# EAGLE schematic gustav2.0 (EAGLE 7.3.0)
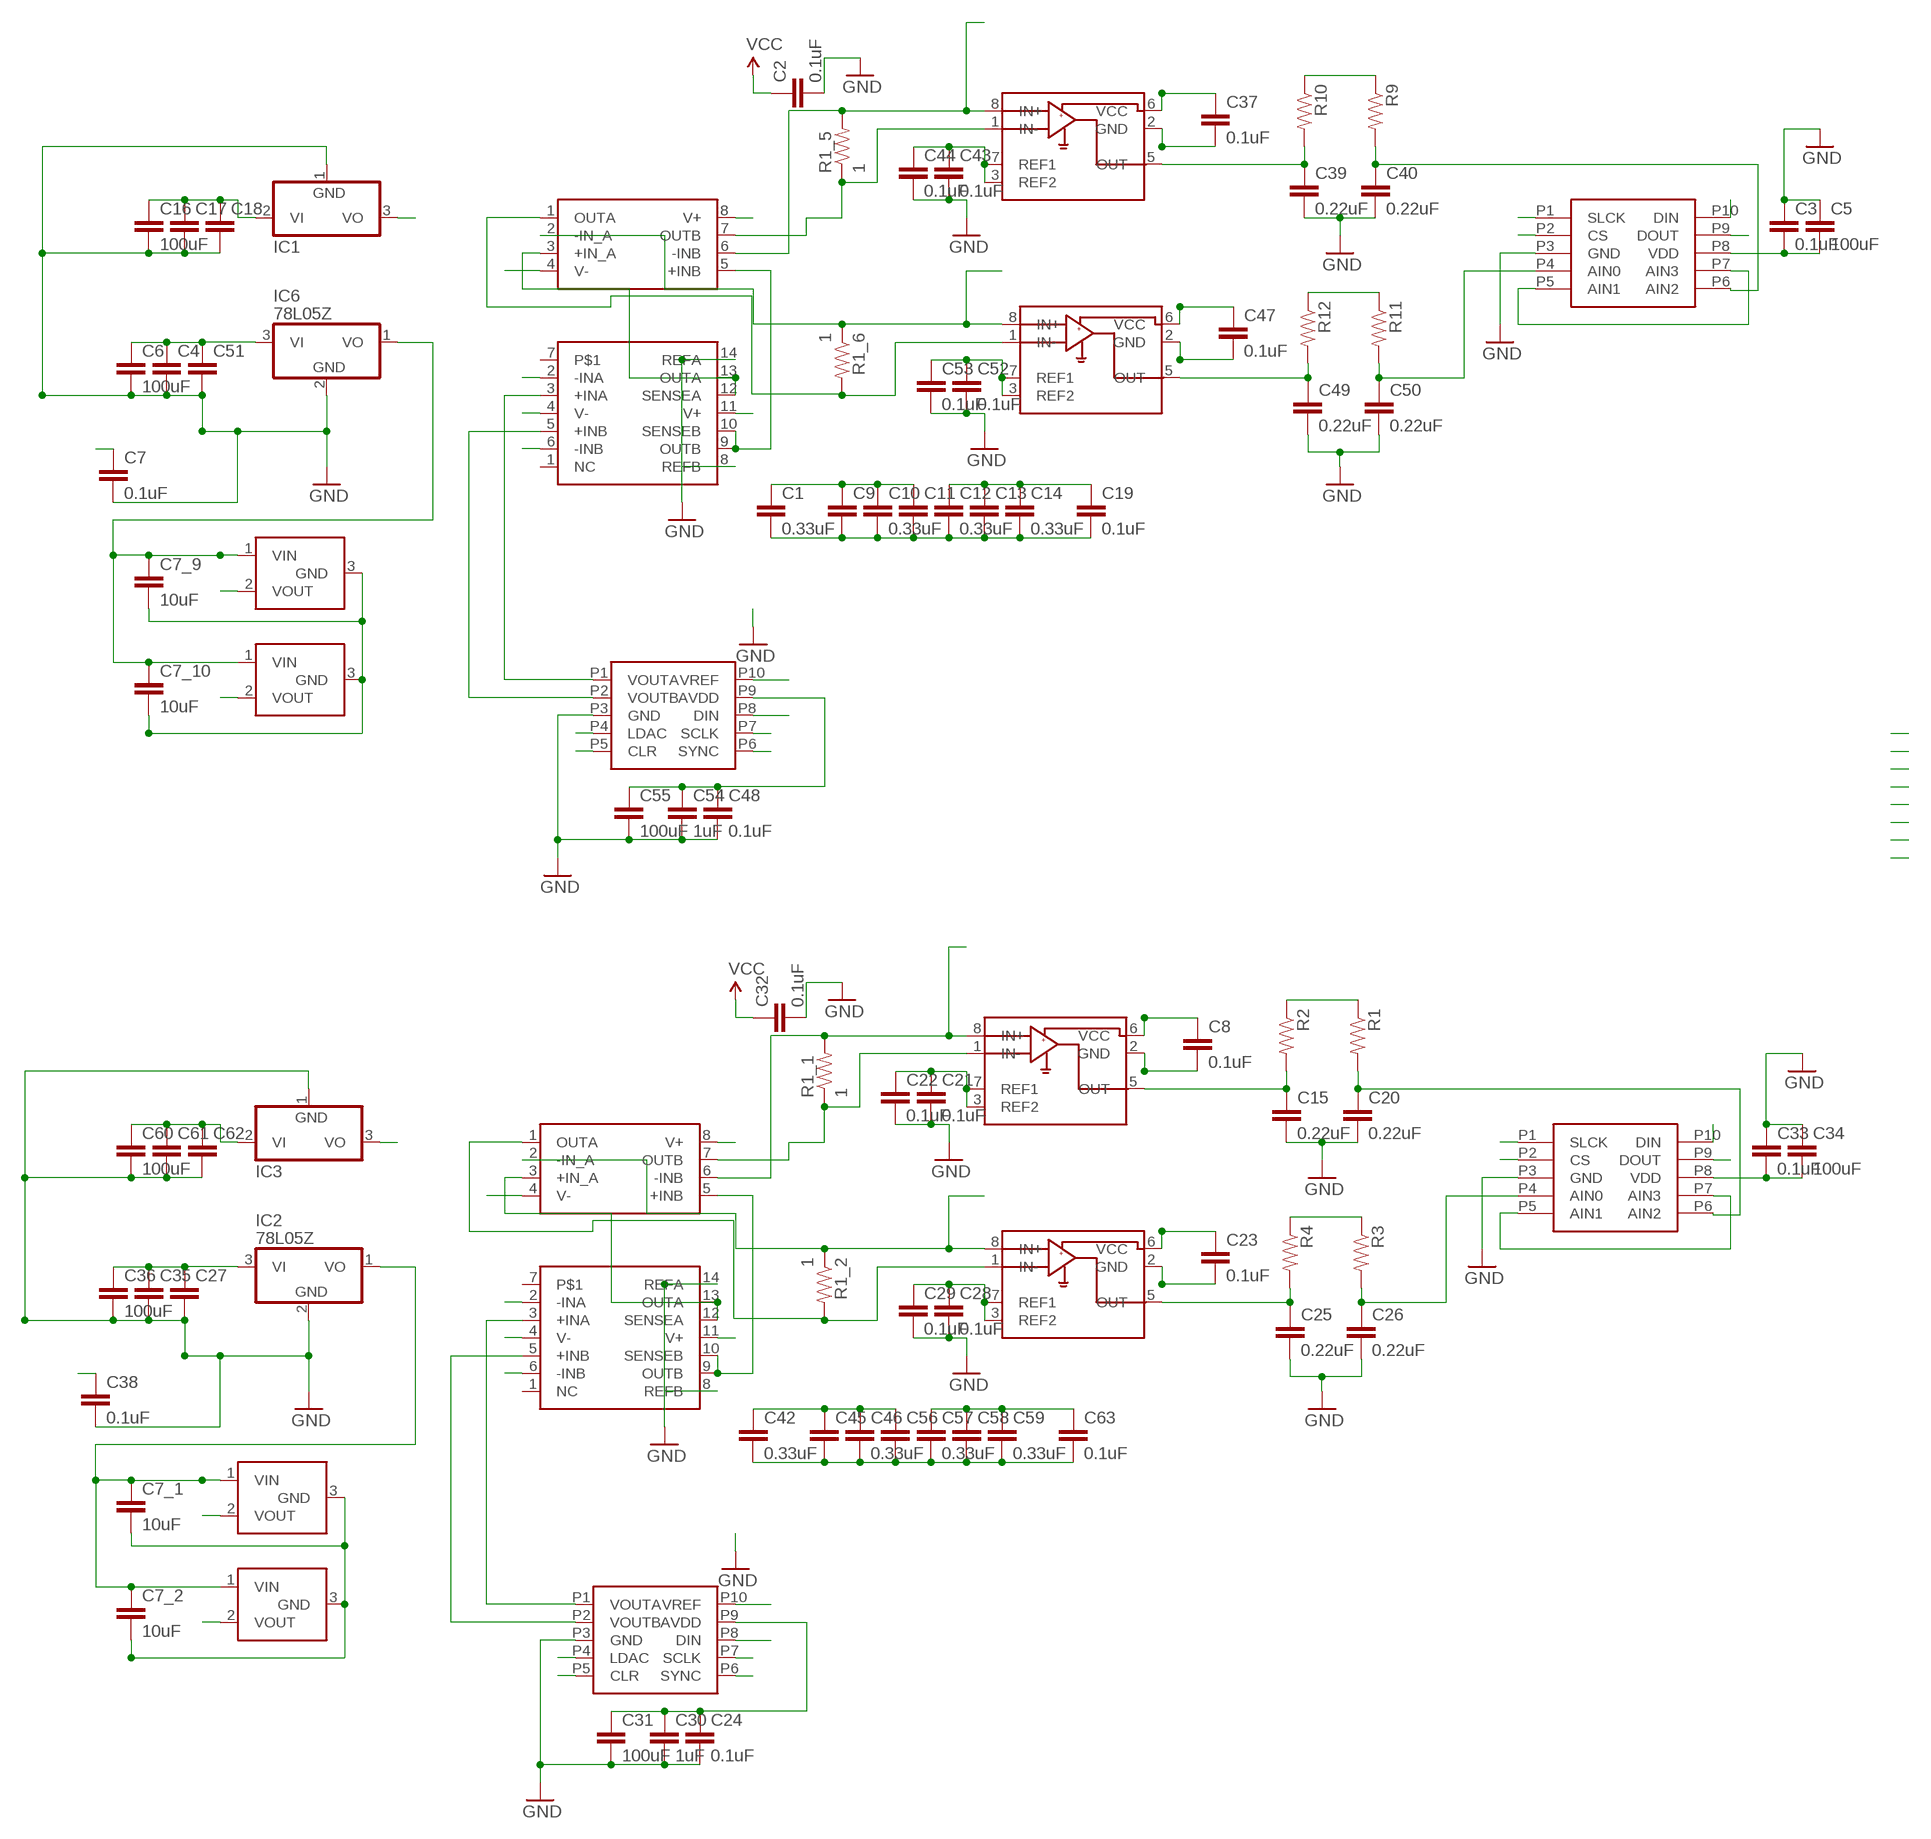
[diagram p0: schematic, sheet 1, part 1 of 3]
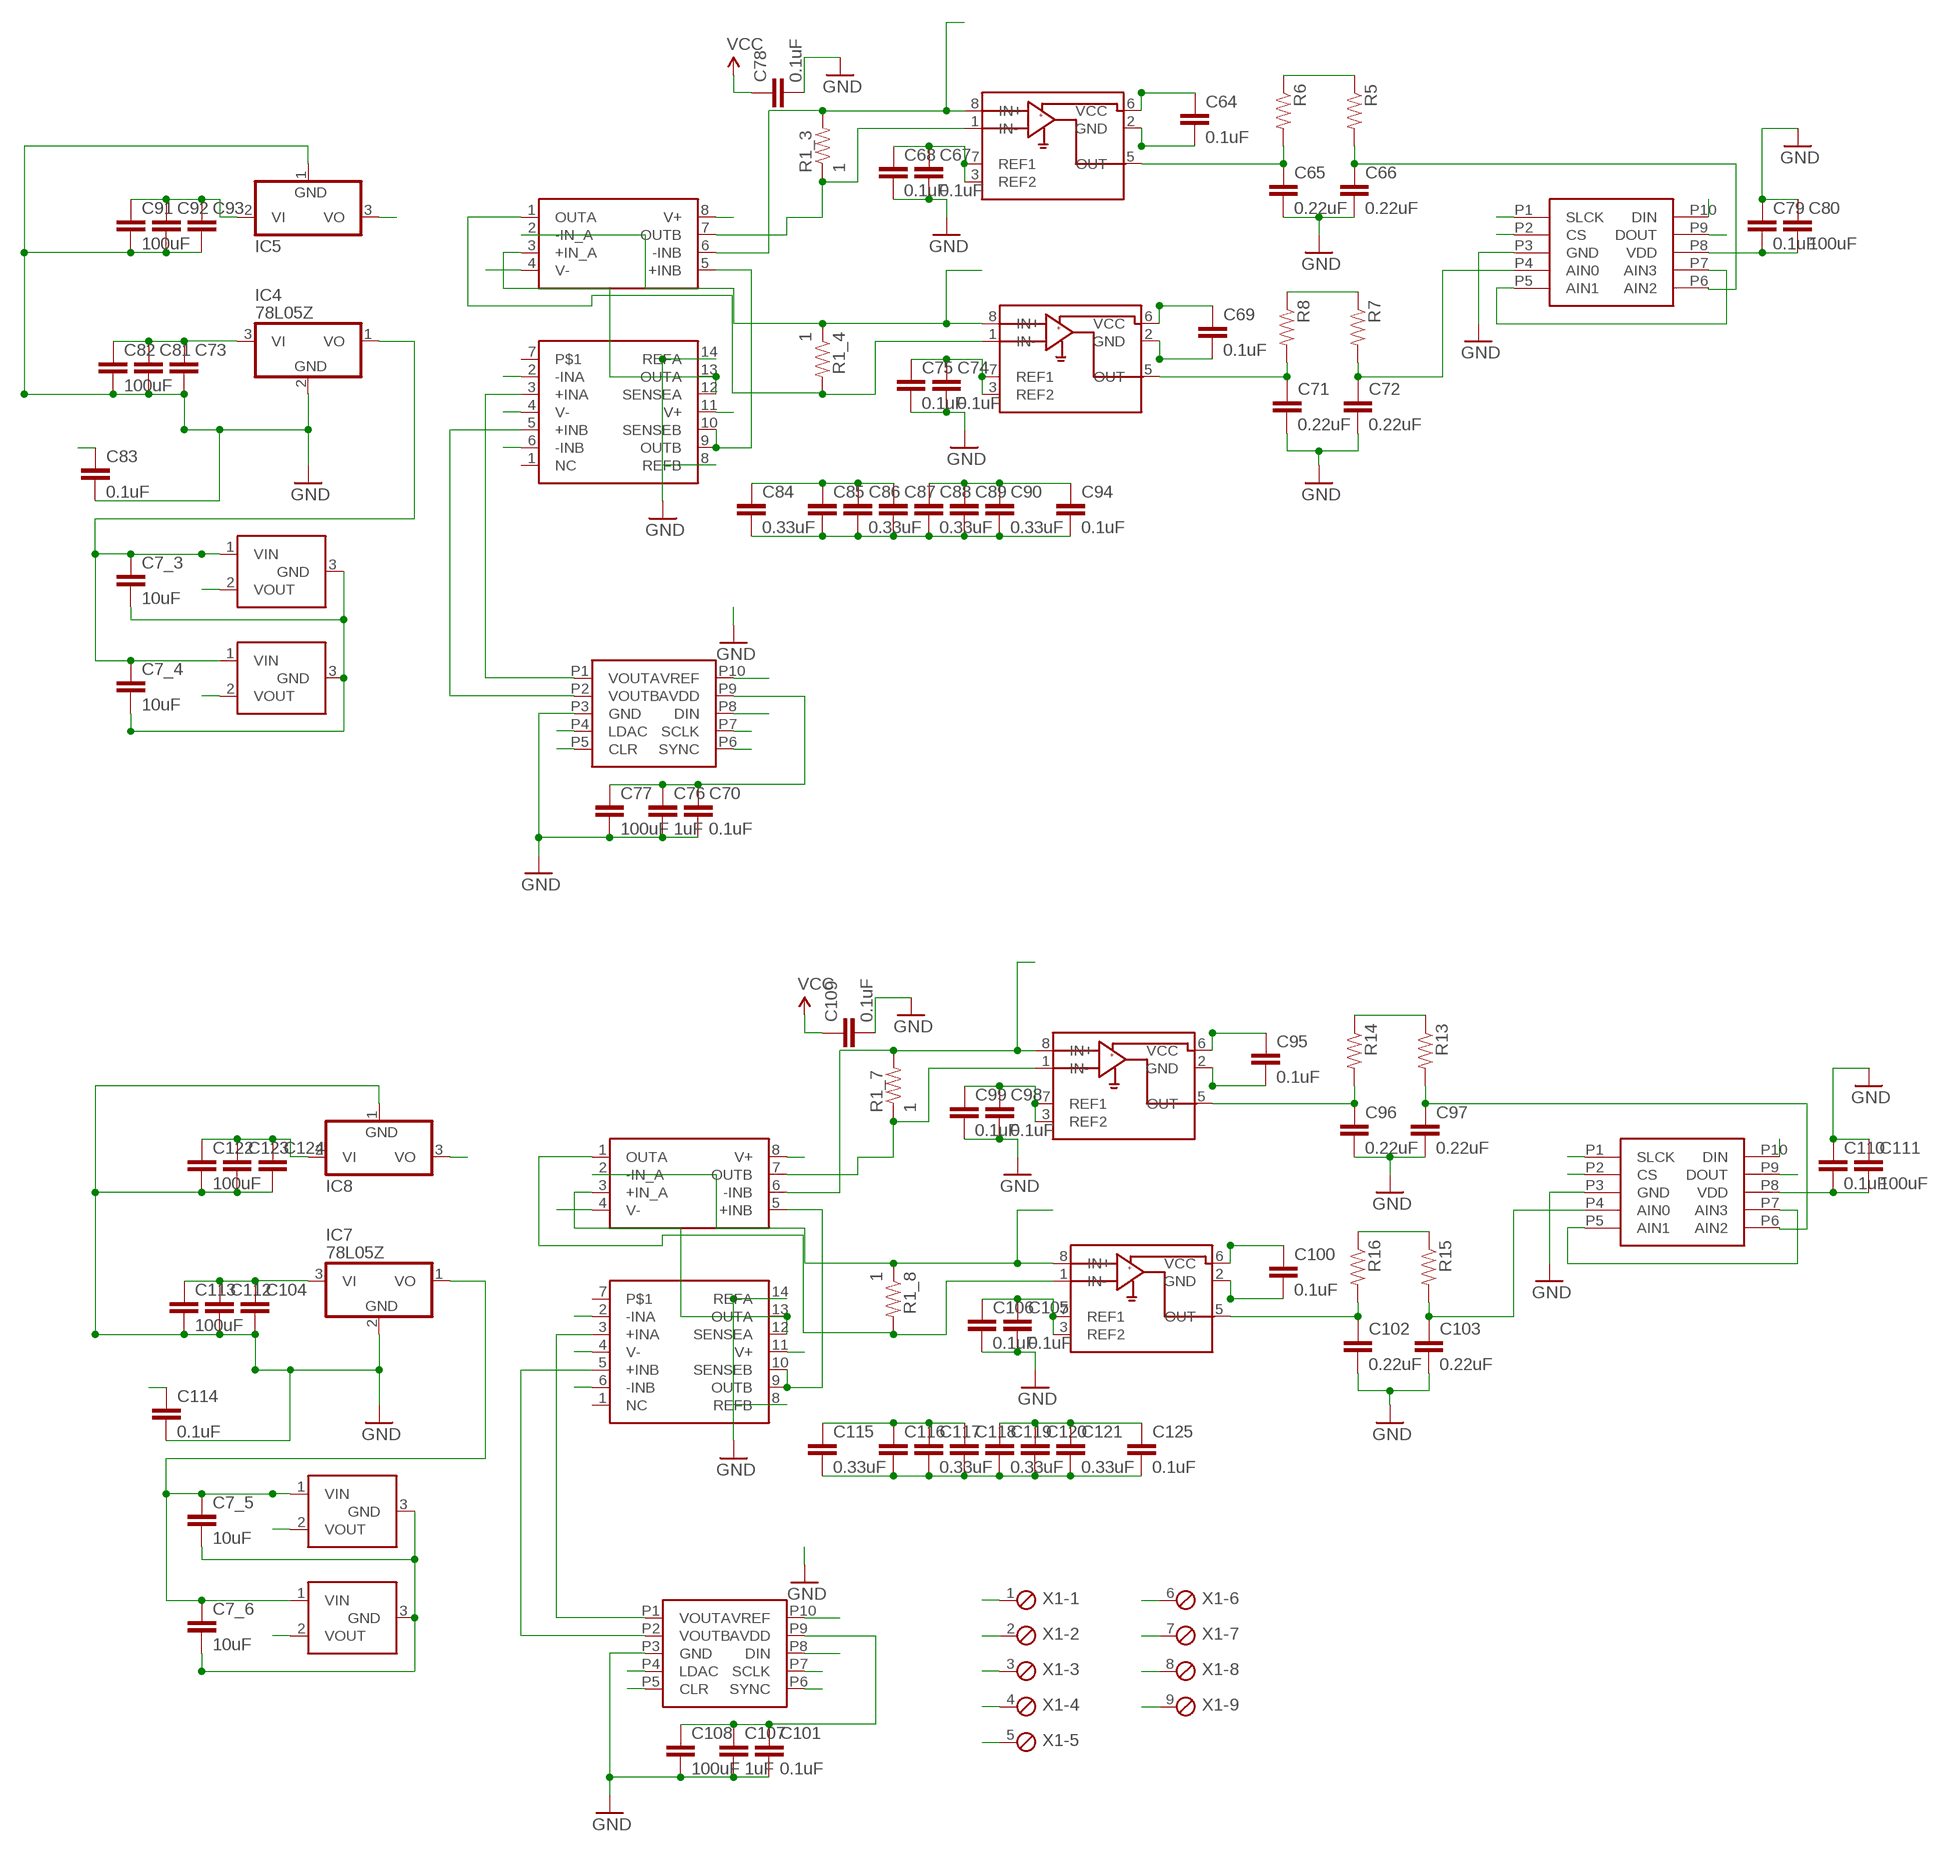
[diagram p1: schematic, sheet 1, part 2 of 3]
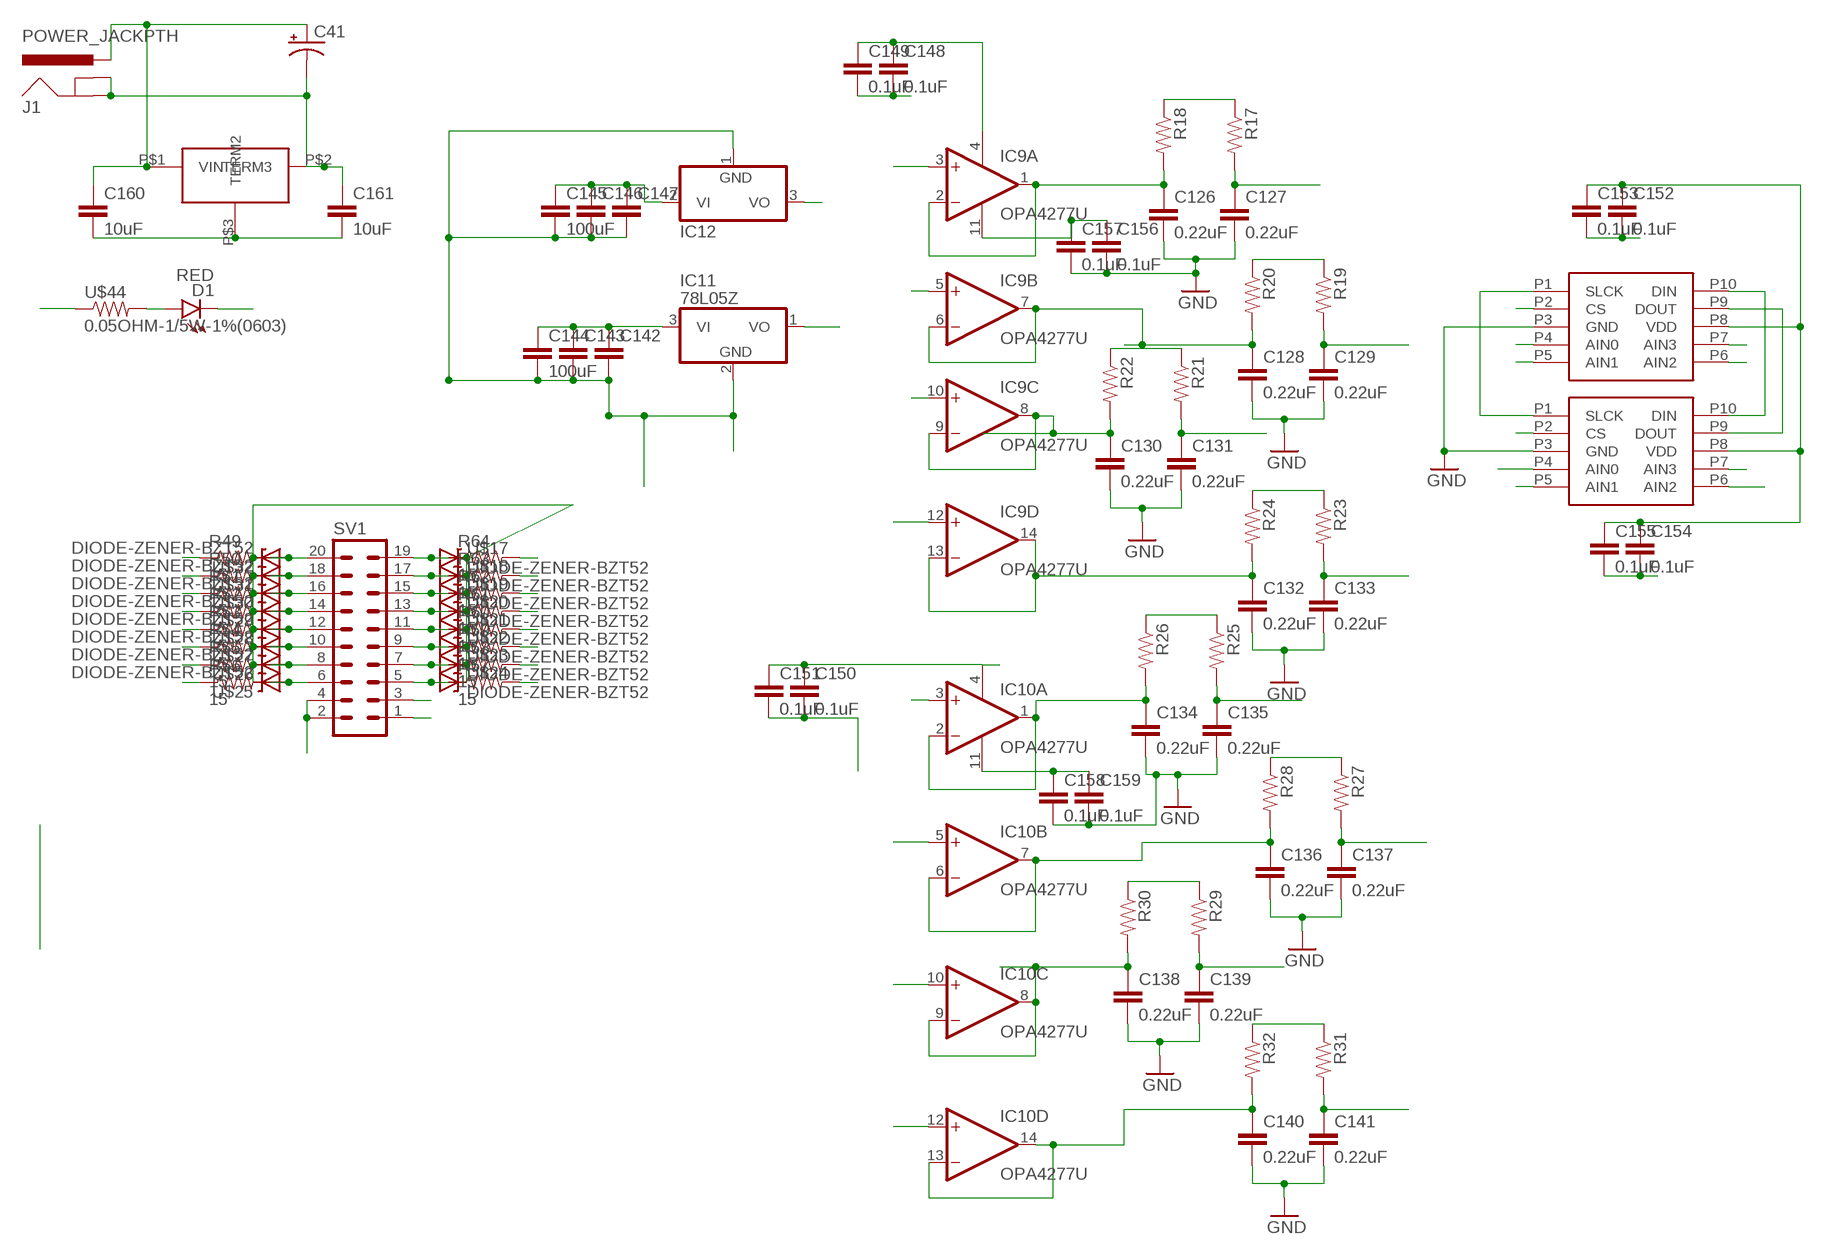
[diagram p2: schematic, sheet 1, part 3 of 3]

## Parts
C1  0.33uF  0.33UF-50V-10%(0805)  [0805-CAP]
C2  0.1uF  CAP0603-CAP  [0603-CAP]
C3  0.1uF  CAP0603-CAP  [0603-CAP]
C4  CAP0603-CAP  [0603-CAP]
C5  100uF  1.0UF50V10%(1206)  [1206-CAP]
C6  100uF  1.0UF50V10%(1206)  [1206-CAP]
C7  0.1uF  0.1UF-25V-5%(0603)  [0603-CAP]
C7_1  10uF  CAP0603-CAP  [0603-CAP]
C7_2  10uF  CAP0603-CAP  [0603-CAP]
C7_3  10uF  CAP0603-CAP  [0603-CAP]
C7_4  10uF  CAP0603-CAP  [0603-CAP]
C7_5  10uF  CAP0603-CAP  [0603-CAP]
C7_6  10uF  CAP0603-CAP  [0603-CAP]
C7_9  10uF  CAP0603-CAP  [0603-CAP]
C7_10  10uF  CAP0603-CAP  [0603-CAP]
C8  0.1uF  CAP0603-CAP  [0603-CAP]
C9  CAP0603-CAP  [0603-CAP]
C10  0.33uF  0.33UF-50V-10%(0805)  [0805-CAP]
C11  CAP0603-CAP  [0603-CAP]
C12  0.33uF  0.33UF-50V-10%(0805)  [0805-CAP]
C13  CAP0603-CAP  [0603-CAP]
C14  0.33uF  0.33UF-50V-10%(0805)  [0805-CAP]
C15  0.22uF  0.22UF50V-20%,+80%(0603)  [0603-CAP]
C16  100uF  1.0UF50V10%(1206)  [1206-CAP]
C17  CAP0603-CAP  [0603-CAP]
C18  CAP0603-CAP  [0603-CAP]
C19  0.1uF  0.1UF-25V-5%(0603)  [0603-CAP]
C20  0.22uF  0.22UF50V-20%,+80%(0603)  [0603-CAP]
C21  0.1uF  CAP0603-CAP  [0603-CAP]
C22  0.1uF  CAP0603-CAP  [0603-CAP]
C23  0.1uF  CAP0603-CAP  [0603-CAP]
C24  0.1uF  CAP0603-CAP  [0603-CAP]
C25  0.22uF  0.22UF50V-20%,+80%(0603)  [0603-CAP]
C26  0.22uF  0.22UF50V-20%,+80%(0603)  [0603-CAP]
C27  CAP0603-CAP  [0603-CAP]
C28  0.1uF  CAP0603-CAP  [0603-CAP]
C29  0.1uF  CAP0603-CAP  [0603-CAP]
C30  1uF  CAP0603-CAP  [0603-CAP]
C31  100uF  1.0UF50V10%(1206)  [1206-CAP]
C32  0.1uF  CAP0603-CAP  [0603-CAP]
C33  0.1uF  CAP0603-CAP  [0603-CAP]
C34  100uF  1.0UF50V10%(1206)  [1206-CAP]
C35  CAP0603-CAP  [0603-CAP]
C36  100uF  1.0UF50V10%(1206)  [1206-CAP]
C37  0.1uF  CAP0603-CAP  [0603-CAP]
C38  0.1uF  0.1UF-25V-5%(0603)  [0603-CAP]
C39  0.22uF  0.22UF50V-20%,+80%(0603)  [0603-CAP]
C40  0.22uF  0.22UF50V-20%,+80%(0603)  [0603-CAP]
C41  CAP_POLPTH1  [CPOL-RADIAL-100UF-25V]
C42  0.33uF  0.33UF-50V-10%(0805)  [0805-CAP]
C43  0.1uF  CAP0603-CAP  [0603-CAP]
C44  0.1uF  CAP0603-CAP  [0603-CAP]
C45  CAP0603-CAP  [0603-CAP]
C46  0.33uF  0.33UF-50V-10%(0805)  [0805-CAP]
C47  0.1uF  CAP0603-CAP  [0603-CAP]
C48  0.1uF  CAP0603-CAP  [0603-CAP]
C49  0.22uF  0.22UF50V-20%,+80%(0603)  [0603-CAP]
C50  0.22uF  0.22UF50V-20%,+80%(0603)  [0603-CAP]
C51  CAP0603-CAP  [0603-CAP]
C52  0.1uF  CAP0603-CAP  [0603-CAP]
C53  0.1uF  CAP0603-CAP  [0603-CAP]
C54  1uF  CAP0603-CAP  [0603-CAP]
C55  100uF  1.0UF50V10%(1206)  [1206-CAP]
C56  CAP0603-CAP  [0603-CAP]
C57  0.33uF  0.33UF-50V-10%(0805)  [0805-CAP]
C58  CAP0603-CAP  [0603-CAP]
C59  0.33uF  0.33UF-50V-10%(0805)  [0805-CAP]
C60  100uF  1.0UF50V10%(1206)  [1206-CAP]
C61  CAP0603-CAP  [0603-CAP]
C62  CAP0603-CAP  [0603-CAP]
C63  0.1uF  0.1UF-25V-5%(0603)  [0603-CAP]
C64  0.1uF  CAP0603-CAP  [0603-CAP]
C65  0.22uF  0.22UF50V-20%,+80%(0603)  [0603-CAP]
C66  0.22uF  0.22UF50V-20%,+80%(0603)  [0603-CAP]
C67  0.1uF  CAP0603-CAP  [0603-CAP]
C68  0.1uF  CAP0603-CAP  [0603-CAP]
C69  0.1uF  CAP0603-CAP  [0603-CAP]
C70  0.1uF  CAP0603-CAP  [0603-CAP]
C71  0.22uF  0.22UF50V-20%,+80%(0603)  [0603-CAP]
C72  0.22uF  0.22UF50V-20%,+80%(0603)  [0603-CAP]
C73  CAP0603-CAP  [0603-CAP]
C74  0.1uF  CAP0603-CAP  [0603-CAP]
C75  0.1uF  CAP0603-CAP  [0603-CAP]
C76  1uF  CAP0603-CAP  [0603-CAP]
C77  100uF  1.0UF50V10%(1206)  [1206-CAP]
C78  0.1uF  CAP0603-CAP  [0603-CAP]
C79  0.1uF  CAP0603-CAP  [0603-CAP]
C80  100uF  1.0UF50V10%(1206)  [1206-CAP]
C81  CAP0603-CAP  [0603-CAP]
C82  100uF  1.0UF50V10%(1206)  [1206-CAP]
C83  0.1uF  0.1UF-25V-5%(0603)  [0603-CAP]
C84  0.33uF  0.33UF-50V-10%(0805)  [0805-CAP]
C85  CAP0603-CAP  [0603-CAP]
C86  0.33uF  0.33UF-50V-10%(0805)  [0805-CAP]
C87  CAP0603-CAP  [0603-CAP]
C88  0.33uF  0.33UF-50V-10%(0805)  [0805-CAP]
C89  CAP0603-CAP  [0603-CAP]
C90  0.33uF  0.33UF-50V-10%(0805)  [0805-CAP]
C91  100uF  1.0UF50V10%(1206)  [1206-CAP]
C92  CAP0603-CAP  [0603-CAP]
C93  CAP0603-CAP  [0603-CAP]
C94  0.1uF  0.1UF-25V-5%(0603)  [0603-CAP]
C95  0.1uF  CAP0603-CAP  [0603-CAP]
C96  0.22uF  0.22UF50V-20%,+80%(0603)  [0603-CAP]
C97  0.22uF  0.22UF50V-20%,+80%(0603)  [0603-CAP]
C98  0.1uF  CAP0603-CAP  [0603-CAP]
C99  0.1uF  CAP0603-CAP  [0603-CAP]
C100  0.1uF  CAP0603-CAP  [0603-CAP]
C101  0.1uF  CAP0603-CAP  [0603-CAP]
C102  0.22uF  0.22UF50V-20%,+80%(0603)  [0603-CAP]
C103  0.22uF  0.22UF50V-20%,+80%(0603)  [0603-CAP]
C104  CAP0603-CAP  [0603-CAP]
C105  0.1uF  CAP0603-CAP  [0603-CAP]
C106  0.1uF  CAP0603-CAP  [0603-CAP]
C107  1uF  CAP0603-CAP  [0603-CAP]
C108  100uF  1.0UF50V10%(1206)  [1206-CAP]
C109  0.1uF  CAP0603-CAP  [0603-CAP]
C110  0.1uF  CAP0603-CAP  [0603-CAP]
C111  100uF  1.0UF50V10%(1206)  [1206-CAP]
C112  CAP0603-CAP  [0603-CAP]
C113  100uF  1.0UF50V10%(1206)  [1206-CAP]
C114  0.1uF  0.1UF-25V-5%(0603)  [0603-CAP]
C115  0.33uF  0.33UF-50V-10%(0805)  [0805-CAP]
C116  CAP0603-CAP  [0603-CAP]
C117  0.33uF  0.33UF-50V-10%(0805)  [0805-CAP]
C118  CAP0603-CAP  [0603-CAP]
C119  0.33uF  0.33UF-50V-10%(0805)  [0805-CAP]
C120  CAP0603-CAP  [0603-CAP]
C121  0.33uF  0.33UF-50V-10%(0805)  [0805-CAP]
C122  100uF  1.0UF50V10%(1206)  [1206-CAP]
C123  CAP0603-CAP  [0603-CAP]
C124  CAP0603-CAP  [0603-CAP]
C125  0.1uF  0.1UF-25V-5%(0603)  [0603-CAP]
C126  0.22uF  0.22UF50V-20%,+80%(0603)  [0603-CAP]
C127  0.22uF  0.22UF50V-20%,+80%(0603)  [0603-CAP]
C128  0.22uF  0.22UF50V-20%,+80%(0603)  [0603-CAP]
C129  0.22uF  0.22UF50V-20%,+80%(0603)  [0603-CAP]
C130  0.22uF  0.22UF50V-20%,+80%(0603)  [0603-CAP]
C131  0.22uF  0.22UF50V-20%,+80%(0603)  [0603-CAP]
C132  0.22uF  0.22UF50V-20%,+80%(0603)  [0603-CAP]
C133  0.22uF  0.22UF50V-20%,+80%(0603)  [0603-CAP]
C134  0.22uF  0.22UF50V-20%,+80%(0603)  [0603-CAP]
C135  0.22uF  0.22UF50V-20%,+80%(0603)  [0603-CAP]
C136  0.22uF  0.22UF50V-20%,+80%(0603)  [0603-CAP]
C137  0.22uF  0.22UF50V-20%,+80%(0603)  [0603-CAP]
C138  0.22uF  0.22UF50V-20%,+80%(0603)  [0603-CAP]
C139  0.22uF  0.22UF50V-20%,+80%(0603)  [0603-CAP]
C140  0.22uF  0.22UF50V-20%,+80%(0603)  [0603-CAP]
C141  0.22uF  0.22UF50V-20%,+80%(0603)  [0603-CAP]
C142  CAP0603-CAP  [0603-CAP]
C143  CAP0603-CAP  [0603-CAP]
C144  100uF  1.0UF50V10%(1206)  [1206-CAP]
C145  100uF  1.0UF50V10%(1206)  [1206-CAP]
C146  CAP0603-CAP  [0603-CAP]
C147  CAP0603-CAP  [0603-CAP]
C148  0.1uF  CAP0603-CAP  [0603-CAP]
C149  0.1uF  CAP0603-CAP  [0603-CAP]
C150  0.1uF  CAP0603-CAP  [0603-CAP]
C151  0.1uF  CAP0603-CAP  [0603-CAP]
C152  0.1uF  CAP0603-CAP  [0603-CAP]
C153  0.1uF  CAP0603-CAP  [0603-CAP]
C154  0.1uF  CAP0603-CAP  [0603-CAP]
C155  0.1uF  CAP0603-CAP  [0603-CAP]
C156  0.1uF  CAP0603-CAP  [0603-CAP]
C157  0.1uF  CAP0603-CAP  [0603-CAP]
C158  0.1uF  CAP0603-CAP  [0603-CAP]
C159  0.1uF  CAP0603-CAP  [0603-CAP]
C160  10uF  10UF-6.3V-20%(0603)  [0603-CAP]
C161  10uF  10UF-6.3V-20%(0603)  [0603-CAP]
D1  RED  LED-RED1206  [LED-1206]
IC1  79L05Z  [TO92]
IC2  78L05Z  [TO92]
IC3  79L05Z  [TO92]
IC4  78L05Z  [TO92]
IC5  79L05Z  [TO92]
IC6  78L05Z  [TO92]
IC7  78L05Z  [TO92]
IC8  79L05Z  [TO92]
IC9  OPA4277U  [SO14]
IC10  OPA4277U  [SO14]
IC11  78L05Z  [TO92]
IC12  79L05Z  [TO92]
J1  POWER_JACKPTH  [POWER_JACK_PTH]
R1  RESISTOR0603-RES  [0603-RES]
R1_1  1  RESISTOR0603-RES  [0603-RES]
R1_2  1  RESISTOR0603-RES  [0603-RES]
R1_3  1  RESISTOR0603-RES  [0603-RES]
R1_4  1  RESISTOR0603-RES  [0603-RES]
R1_5  1  RESISTOR0603-RES  [0603-RES]
R1_6  1  RESISTOR0603-RES  [0603-RES]
R1_7  1  RESISTOR0603-RES  [0603-RES]
R1_8  1  RESISTOR0603-RES  [0603-RES]
R2  RESISTOR0603-RES  [0603-RES]
R3  RESISTOR0603-RES  [0603-RES]
R4  RESISTOR0603-RES  [0603-RES]
R5  RESISTOR0603-RES  [0603-RES]
R6  RESISTOR0603-RES  [0603-RES]
R7  RESISTOR0603-RES  [0603-RES]
R8  RESISTOR0603-RES  [0603-RES]
R9  RESISTOR0603-RES  [0603-RES]
R10  RESISTOR0603-RES  [0603-RES]
R11  RESISTOR0603-RES  [0603-RES]
R12  RESISTOR0603-RES  [0603-RES]
R13  RESISTOR0603-RES  [0603-RES]
R14  RESISTOR0603-RES  [0603-RES]
R15  RESISTOR0603-RES  [0603-RES]
R16  RESISTOR0603-RES  [0603-RES]
R17  RESISTOR0603-RES  [0603-RES]
R18  RESISTOR0603-RES  [0603-RES]
R19  RESISTOR0603-RES  [0603-RES]
R20  RESISTOR0603-RES  [0603-RES]
R21  RESISTOR0603-RES  [0603-RES]
R22  RESISTOR0603-RES  [0603-RES]
R23  RESISTOR0603-RES  [0603-RES]
R24  RESISTOR0603-RES  [0603-RES]
R25  RESISTOR0603-RES  [0603-RES]
R26  RESISTOR0603-RES  [0603-RES]
R27  RESISTOR0603-RES  [0603-RES]
R28  RESISTOR0603-RES  [0603-RES]
R29  RESISTOR0603-RES  [0603-RES]
R30  RESISTOR0603-RES  [0603-RES]
R31  RESISTOR0603-RES  [0603-RES]
R32  RESISTOR0603-RES  [0603-RES]
R49  15  15OHM-1/10W-1%(0603)0603  [0603-RES]
R50  15  15OHM-1/10W-1%(0603)0603  [0603-RES]
R51  15  15OHM-1/10W-1%(0603)0603  [0603-RES]
R52  15  15OHM-1/10W-1%(0603)0603  [0603-RES]
R53  15  15OHM-1/10W-1%(0603)0603  [0603-RES]
R54  15  15OHM-1/10W-1%(0603)0603  [0603-RES]
R55  15  15OHM-1/10W-1%(0603)0603  [0603-RES]
R56  15  15OHM-1/10W-1%(0603)0603  [0603-RES]
R57  15  15OHM-1/10W-1%(0603)0603  [0603-RES]
R58  15  15OHM-1/10W-1%(0603)0603  [0603-RES]
R59  15  15OHM-1/10W-1%(0603)0603  [0603-RES]
R60  15  15OHM-1/10W-1%(0603)0603  [0603-RES]
R61  15  15OHM-1/10W-1%(0603)0603  [0603-RES]
R62  15  15OHM-1/10W-1%(0603)0603  [0603-RES]
R63  15  15OHM-1/10W-1%(0603)0603  [0603-RES]
R64  15  15OHM-1/10W-1%(0603)0603  [0603-RES]
REF1  REF3020  [DBZ_R-PDSO-G3]
REF2  REF3020  [DBZ_R-PDSO-G3]
REF3  REF3020  [DBZ_R-PDSO-G3]
REF4  REF3020  [DBZ_R-PDSO-G3]
REF5  REF3020  [DBZ_R-PDSO-G3]
REF6  REF3020  [DBZ_R-PDSO-G3]
REF3020  REF3020  [DBZ_R-PDSO-G3]
REF3040  REF3020  [DBZ_R-PDSO-G3]
SV1  ML20  [ML20]
U$1  ADS1018  [S-PDSO-G10]
U$2  INA2132REALONE  [SO-14]
U$3  DAC7563  [S-PDSO-G10]
U$4  LM7322  [S-PDSO-G08-NOTHERMALPAD]
U$5  ADS1018  [S-PDSO-G10]
U$6  INA285  [SO-08]
U$7  INA285  [SO-08]
U$8  INA285  [SO-08]
U$9  INA285  [SO-08]
U$10  INA2132REALONE  [SO-14]
U$11  LM7322  [S-PDSO-G08-NOTHERMALPAD]
U$12  DAC7563  [S-PDSO-G10]
U$13  ADS1018  [S-PDSO-G10]
U$14  INA285  [SO-08]
U$15  INA285  [SO-08]
U$16  INA2132REALONE  [SO-14]
U$17  DIODE-ZENER-BZT52  [SOD-323]
U$18  DIODE-ZENER-BZT52  [SOD-323]
U$19  DIODE-ZENER-BZT52  [SOD-323]
U$20  DIODE-ZENER-BZT52  [SOD-323]
U$21  DIODE-ZENER-BZT52  [SOD-323]
U$22  DIODE-ZENER-BZT52  [SOD-323]
U$23  DIODE-ZENER-BZT52  [SOD-323]
U$24  DIODE-ZENER-BZT52  [SOD-323]
U$25  DIODE-ZENER-BZT52  [SOD-323]
U$26  DIODE-ZENER-BZT52  [SOD-323]
U$27  DIODE-ZENER-BZT52  [SOD-323]
U$28  DIODE-ZENER-BZT52  [SOD-323]
U$29  DIODE-ZENER-BZT52  [SOD-323]
U$30  DIODE-ZENER-BZT52  [SOD-323]
U$31  DIODE-ZENER-BZT52  [SOD-323]
U$32  DIODE-ZENER-BZT52  [SOD-323]
U$33  LM7322  [S-PDSO-G08-NOTHERMALPAD]
U$34  DAC7563  [S-PDSO-G10]
U$35  ADS1018  [S-PDSO-G10]
U$36  INA285  [SO-08]
U$37  INA285  [SO-08]
U$38  INA2132REALONE  [SO-14]
U$39  LM7322  [S-PDSO-G08-NOTHERMALPAD]
U$40  DAC7563  [S-PDSO-G10]
U$41  ADS1018  [S-PDSO-G10]
U$42  ADS1018  [S-PDSO-G10]
U$43  TSRN  [TSRN1]
U$44  0.05OHM-1/5W-1%(0603)  [0603]
X1  MPT9  [9POL254]

## Nets
_ADC1: R1.1 R2.1
_ADC2: R5.1 R6.1
_ADC3: R13.1 R14.1
_ADC5: R9.1 R10.1
ADC: R53.1 U$5.P2(CS)
ADC1: R52.1 U$1.P2(CS)
ADC1_1: R63.1 SV1.17 U$18.2(A)
ADC2_1: R61.1 SV1.13 U$20.2(A)
ADC3: R54.1 U$13.P2(CS)
ADC3_1: R59.1 SV1.9 U$22.2(A)
ADC4: R55.1 U$35.P2(CS)
ADC4_1: R57.1 SV1.5 U$24.2(A)
ADCCS3: R57.2 U$42.P2(CS)
ADCCS4: R56.1 U$41.P2(CS)
ADCDIN: R62.2 U$1.P10(DIN) U$5.P10(DIN) U$13.P10(DIN) U$35.P10(DIN) U$41.P10(DIN) U$42.P10(DIN)
ADCDIN_1: R50.2 SV1.18 U$31.2(A)
ADCDOUT: R50.1 U$1.P9(DOUT) U$5.P9(DOUT) U$13.P9(DOUT) U$35.P9(DOUT) U$41.P9(DOUT) U$42.P9(DOUT)
ADCDOUT_1: R51.2 SV1.16 U$30.2(A)
ADSINA: C50.1 R11.2 U$1.P4(AIN0)
ADSINA1: C26.1 R3.2 U$5.P4(AIN0)
ADSINA2: C72.1 R7.2 U$13.P4(AIN0)
ADSINA3: C103.1 R15.2 U$35.P4(AIN0)
ADSINB: C40.1 R9.2 U$1.P6(AIN2)
ADSINB1: C20.1 R1.2 U$5.P6(AIN2)
ADSINB2: C66.1 R5.2 U$13.P6(AIN2)
ADSINB3: C97.1 R13.2 U$35.P6(AIN2)
CLK_1: R49.2 SV1.20 U$32.2(A)
CLR: R51.1 U$3.P5(CLR) U$12.P5(CLR) U$34.P5(CLR) U$40.P5(CLR)
CLR_1: R54.2 SV1.10 U$27.2(A)
D1: IC9.3(A:+IN) R1_5.2 U$4.6(-INB) U$7.8(IN+) X1.2
D2: IC9.5(B:+IN) R1_6.1 U$4.2(-IN_A) U$8.8(IN+) X1.1
D3: IC9.10(C:+IN) R1_1.2 U$6.8(IN+) U$11.6(-INB) X1.4
D4: IC9.12(D:+IN) R1_2.1 U$9.8(IN+) U$11.2(-IN_A) X1.3
D5: IC10.10(C:+IN) R1_3.2 U$14.8(IN+) U$33.6(-INB) X1.7
D6: IC10.12(D:+IN) R1_4.1 U$15.8(IN+) U$33.2(-IN_A) X1.6
D7: IC10.3(A:+IN) R1_7.2 U$36.8(IN+) U$39.6(-INB) X1.9
D8: IC10.5(B:+IN) R1_8.1 U$37.8(IN+) U$39.2(-IN_A) X1.8
DAC1: R61.2 U$3.P6(SYNC)
DAC1_1: R64.1 SV1.19 U$17.2(A)
DAC2: R60.2 U$12.P6(SYNC)
DAC2_1: R62.1 SV1.15 U$19.2(A)
DAC3: R59.2 U$34.P6(SYNC)
DAC3_1: R60.1 SV1.11 U$21.2(A)
DAC4: R58.2 U$40.P6(SYNC)
DAC4_1: R58.1 SV1.7 U$23.2(A)
GND: C1.2 C2.2 C3.1 C4.2 C5.1 C6.2 C7.2 C7_1.2 C7_2.2 C7_3.2 C7_4.2 C7_5.2 C7_6.2 C7_9.2 C7_10.2 C8.2 C9.2 C10.2 C11.2 C12.2 C13.2 C14.2 C15.2 C16.2 C17.2 C18.2 C19.2 C20.2 C21.2 C22.2 C23.2 C24.2 C25.2 C26.2 C27.2 C28.2 C29.2 C30.2 C31.2 C32.2 C33.1 C34.1 C35.2 C36.2 C37.2 C38.2 C39.2 C40.2 C41.2(-) C42.2 C43.2 C44.2 C45.2 C46.2 C47.2 C48.2 C49.2 C50.2 C51.2 C52.2 C53.2 C54.2 C55.2 C56.2 C57.2 C58.2 C59.2 C60.2 C61.2 C62.2 C63.2 C64.2 C65.2 C66.2 C67.2 C68.2 C69.2 C70.2 C71.2 C72.2 C73.2 C74.2 C75.2 C76.2 C77.2 C78.2 C79.1 C80.1 C81.2 C82.2 C83.2 C84.2 C85.2 C86.2 C87.2 C88.2 C89.2 C90.2 C91.2 C92.2 C93.2 C94.2 C95.2 C96.2 C97.2 C98.2 C99.2 C100.2 C101.2 C102.2 C103.2 C104.2 C105.2 C106.2 C107.2 C108.2 C109.2 C110.1 C111.1 C112.2 C113.2 C114.2 C115.2 C116.2 C117.2 C118.2 C119.2 C120.2 C121.2 C122.2 C123.2 C124.2 C125.2 C126.2 C127.2 C128.2 C129.2 C130.2 C131.2 C132.2 C133.2 C134.2 C135.2 C136.2 C137.2 C138.2 C139.2 C140.2 C141.2 C142.2 C143.2 C144.2 C145.2 C146.2 C147.2 C148.2 C149.2 C150.2 C151.2 C152.2 C153.2 C154.2 C155.2 C156.2 C157.2 C158.2 C159.2 C161.1 D1.C IC1.1(GND) IC2.2(GND) IC3.1(GND) IC4.2(GND) IC5.1(GND) IC6.2(GND) IC7.2(GND) IC8.1(GND) IC11.2(GND) IC12.1(GND) J1.GND J1.GNDBREAK REF1.3(GND) REF2.3(GND) REF3.3(GND) REF4.3(GND) REF5.3(GND) REF6.3(GND) REF3020.3(GND) REF3040.3(GND) SV1.2 SV1.4 U$1.P3(GND) U$2.8(REFB) U$2.14(REFA) U$3.P3(GND) U$5.P3(GND) U$6.2(GND) U$7.2(GND) U$8.2(GND) U$9.2(GND) U$10.8(REFB) U$10.14(REFA) U$12.P3(GND) U$13.P3(GND) U$14.2(GND) U$15.2(GND) U$16.8(REFB) U$16.14(REFA) U$17.1(C) U$18.1(C) U$19.1(C) U$20.1(C) U$21.1(C) U$22.1(C) U$23.1(C) U$24.1(C) U$25.1(C) U$26.1(C) U$27.1(C) U$28.1(C) U$29.1(C) U$30.1(C) U$31.1(C) U$32.1(C) U$34.P3(GND) U$35.P3(GND) U$36.2(GND) U$37.2(GND) U$38.8(REFB) U$38.14(REFA) U$40.P3(GND) U$41.P3(GND) U$42.P3(GND) U$43.P$2(TERM3) X1.5
INAOUTB: C49.1 R12.2 U$8.5(OUT)
INAOUTB1: C25.1 R4.2 U$9.5(OUT)
INAOUTB2: C71.1 R8.2 U$15.5(OUT)
INAOUTB3: C102.1 R16.2 U$37.5(OUT)
INAOUTB4: C126.1 IC9.1(A:OUT) IC9.2(A:-IN) R18.2
INAOUTB5: C128.1 IC9.6(B:-IN) IC9.7(B:OUT) R20.2
INAOUTB6: C130.1 IC9.8(C:OUT) IC9.9(C:-IN) R22.2
INAOUTB7: C132.1 IC9.13(D:-IN) IC9.14(D:OUT) R24.2
INAOUTB8: C134.1 IC10.1(A:OUT) IC10.2(A:-IN) R26.2
INAOUTB9: C136.1 IC10.6(B:-IN) IC10.7(B:OUT) R28.2
INAOUTB10: C138.1 IC10.8(C:OUT) IC10.9(C:-IN) R30.2
INAOUTB11: C140.1 IC10.13(D:-IN) IC10.14(D:OUT) R32.2
INOUTA: C39.1 R10.2 U$7.5(OUT)
INOUTA1: C15.1 R2.2 U$6.5(OUT)
INOUTA2: C65.1 R6.2 U$14.5(OUT)
INOUTA3: C96.1 R14.2 U$36.5(OUT)
LDAC: R49.1 U$3.P4(LDAC) U$12.P4(LDAC) U$34.P4(LDAC) U$40.P4(LDAC)
LDAC_1: R53.2 SV1.12 U$28.2(A)
N$1: R3.1 R4.1
N$3: U$2.9(OUTB) U$2.10(SENSEB) U$4.5(+INB)
N$4: U$10.9(OUTB) U$10.10(SENSEB) U$11.5(+INB)
N$5: R11.1 R12.1
N$6: U$2.5(+INB) U$3.P2(VOUTB)
N$7: U$2.12(SENSEA) U$2.13(OUTA) U$4.3(+IN_A)
N$8: U$10.12(SENSEA) U$10.13(OUTA) U$11.3(+IN_A)
N$9: R55.2 SV1.8 U$26.2(A)
N$10: R56.2 SV1.6 U$25.2(A)
N$11: U$10.5(+INB) U$12.P2(VOUTB)
N$12: D1.A U$44.2
N$13: R7.1 R8.1
N$14: U$16.9(OUTB) U$16.10(SENSEB) U$33.5(+INB)
N$15: U$16.12(SENSEA) U$16.13(OUTA) U$33.3(+IN_A)
N$16: U$16.5(+INB) U$34.P2(VOUTB)
N$20: R15.1 R16.1
N$21: U$38.9(OUTB) U$38.10(SENSEB) U$39.5(+INB)
N$22: U$38.12(SENSEA) U$38.13(OUTA) U$39.3(+IN_A)
N$23: U$38.5(+INB) U$40.P2(VOUTB)
N$42: R17.1 R18.1
N$43: R19.1 R20.1
N$45: R21.1 R22.1
N$47: R23.1 R24.1
N$49: R25.1 R26.1
N$51: R27.1 R28.1
N$53: R29.1 R30.1
N$55: R31.1 R32.1
OUTPUTA: R1_6.2 U$4.1(OUTA) U$8.1(IN-)
OUTPUTA1: R1_2.2 U$9.1(IN-) U$11.1(OUTA)
OUTPUTA2: R1_4.2 U$15.1(IN-) U$33.1(OUTA)
OUTPUTA3: R1_8.2 U$37.1(IN-) U$39.1(OUTA)
OUTPUTB: R1_5.1 U$4.7(OUTB) U$7.1(IN-)
OUTPUTB1: R1_1.1 U$6.1(IN-) U$11.7(OUTB)
OUTPUTB2: R1_3.1 U$14.1(IN-) U$33.7(OUTB)
OUTPUTB3: R1_7.1 U$36.1(IN-) U$39.7(OUTB)
REF1: C21.1 C22.1 C28.1 C29.1 REF1.2(VOUT) U$5.P5(AIN1) U$5.P7(AIN3) U$6.3(REF2) U$6.7(REF1) U$9.3(REF2) U$9.7(REF1) U$10.2(-INA) U$10.6(-INB)
REF2: C43.1 C44.1 C52.1 C53.1 REF3020.2(VOUT) U$1.P5(AIN1) U$1.P7(AIN3) U$2.2(-INA) U$2.6(-INB) U$7.3(REF2) U$7.7(REF1) U$8.3(REF2) U$8.7(REF1)
REF3: REF2.2(VOUT) U$12.P10(VREF)
REF4: REF3040.2(VOUT) U$3.P10(VREF)
REF5: C67.1 C68.1 C74.1 C75.1 REF3.2(VOUT) U$13.P5(AIN1) U$13.P7(AIN3) U$14.3(REF2) U$14.7(REF1) U$15.3(REF2) U$15.7(REF1) U$16.2(-INA) U$16.6(-INB)
REF6: REF4.2(VOUT) U$34.P10(VREF)
REF7: C98.1 C99.1 C105.1 C106.1 REF5.2(VOUT) U$35.P5(AIN1) U$35.P7(AIN3) U$36.3(REF2) U$36.7(REF1) U$37.3(REF2) U$37.7(REF1) U$38.2(-INA) U$38.6(-INB)
REF8: REF6.2(VOUT) U$40.P10(VREF)
SCLK: R64.2 U$1.P1(SLCK) U$3.P7(SCLK) U$5.P1(SLCK) U$12.P7(SCLK) U$13.P1(SLCK) U$34.P7(SCLK) U$35.P1(SLCK) U$40.P7(SCLK) U$41.P1(SLCK) U$42.P1(SLCK)
SDIN: R63.2 U$3.P8(DIN) U$12.P8(DIN) U$34.P8(DIN) U$40.P8(DIN)
SDIN_1: R52.2 SV1.14 U$29.2(A)
SENSEA: C127.1 R17.2 U$41.P5(AIN1)
SENSEB: C129.1 R19.2 U$41.P4(AIN0)
SENSEC: C131.1 R21.2 U$41.P7(AIN3)
SENSED: C133.1 R23.2 U$41.P6(AIN2)
SENSEE: C135.1 R25.2 U$42.P7(AIN3)
SENSEF: C137.1 R27.2 U$42.P6(AIN2)
SENSEG: C139.1 R29.2 U$42.P5(AIN1)
SENSEH: C141.1 R31.2 U$42.P4(AIN0)
VCC: C4.1 C6.1 C27.1 C35.1 C36.1 C41.1(+) C51.1 C73.1 C81.1 C82.1 C104.1 C112.1 C113.1 C142.1 C143.1 C144.1 C160.1 IC2.3(VI) IC4.3(VI) IC6.3(VI) IC7.3(VI) IC11.3(VI) J1.PWR SV1.3 U$43.P$1(VIN) U$44.1
VCC-: C16.1 C17.1 C18.1 C60.1 C61.1 C62.1 C91.1 C92.1 C93.1 C122.1 C123.1 C124.1 C145.1 C146.1 C147.1 C160.2 C161.2 IC1.2(VI) IC3.2(VI) IC5.2(VI) IC8.2(VI) IC12.2(VI) SV1.1 U$43.P$3(TERM2)
VOUTA: U$2.3(+INA) U$3.P1(VOUTA)
VOUTA1: U$10.3(+INA) U$12.P1(VOUTA)
VOUTA2: U$16.3(+INA) U$34.P1(VOUTA)
VOUTA3: U$38.3(+INA) U$40.P1(VOUTA)
VREF: C1.1 C2.1 C3.2 C5.2 C7.1 C7_9.1 C7_10.1 C9.1 C10.1 C11.1 C37.1 C47.1 C48.1 C54.1 C55.1 IC6.1(VO) REF3020.1(VIN) REF3040.1(VIN) U$1.P8(VDD) U$2.11(V+) U$3.P9(AVDD) U$4.8(V+) U$7.6(VCC) U$8.6(VCC) ; supply symbol labelled VCC
VREF1: C7_1.1 C7_2.1 C8.1 C23.1 C24.1 C30.1 C31.1 C32.1 C33.2 C34.2 C38.1 C42.1 C45.1 C46.1 C56.1 IC2.1(VO) REF1.1(VIN) REF2.1(VIN) U$5.P8(VDD) U$6.6(VCC) U$9.6(VCC) U$10.11(V+) U$11.8(V+) U$12.P9(AVDD) ; supply symbol labelled VCC
VREF2: C7_3.1 C7_4.1 C64.1 C69.1 C70.1 C76.1 C77.1 C78.1 C79.2 C80.2 C83.1 C84.1 C85.1 C86.1 C87.1 IC4.1(VO) REF3.1(VIN) REF4.1(VIN) U$13.P8(VDD) U$14.6(VCC) U$15.6(VCC) U$16.11(V+) U$33.8(V+) U$34.P9(AVDD) ; supply symbol labelled VCC
VREF3: C7_5.1 C7_6.1 C95.1 C100.1 C101.1 C107.1 C108.1 C109.1 C110.2 C111.2 C114.1 C115.1 C116.1 C117.1 C118.1 IC7.1(VO) REF5.1(VIN) REF6.1(VIN) U$35.P8(VDD) U$36.6(VCC) U$37.6(VCC) U$38.11(V+) U$39.8(V+) U$40.P9(AVDD) ; supply symbol labelled VCC
VREF-: C12.1 C13.1 C14.1 C19.1 IC1.3(VO) U$2.4(V-) U$4.4(V-)
VREF-1: C57.1 C58.1 C59.1 C63.1 IC3.3(VO) U$10.4(V-) U$11.4(V-)
VREF-2: C88.1 C89.1 C90.1 C94.1 IC5.3(VO) U$16.4(V-) U$33.4(V-)
VREF-3: C119.1 C120.1 C121.1 C125.1 IC8.3(VO) U$38.4(V-) U$39.4(V-)
VREF-SENSE: C156.1 C157.1 C158.1 C159.1 IC9.11(P:V-) IC10.11(P:V-) IC12.3(VO)
VREFSENSE: C148.1 C149.1 C150.1 C151.1 C152.1 C153.1 C154.1 C155.1 IC9.4(P:V+) IC10.4(P:V+) IC11.1(VO) U$41.P8(VDD) U$42.P8(VDD)
Unconnected: U$2.1(NC) U$2.7 U$10.1(NC) U$10.7 U$16.1(NC) U$16.7 U$38.1(NC) U$38.7

## Library data of the parts
C1 C10 C12 C14 C42 C46 C57 C59 C84 C86 C88 C90 C115 C117 C119 C121 = SparkFun-Capacitors:0.33UF-50V-10%(0805): CAP-08469; PROD_ID: CAP-08469
C2-C4 C7_1-C7_6 C7_9 C7_10 C9 C11 C13 C17 C18 C24 C27 C30 C32 C33 C35 C45 C48 C51 C54 C56 C58 C61 C62 C70 C73 C76 C78 C79 C81 C85 C87 C89 C92 C93 C101 C104 C107 C109 C110 C112 C116 C118 C120 C123 C124 C142 C143 C146 C147 = SparkFun:CAP: Capacitor Standard 0603 ceramic capacitor, and 0.1" leaded capacitor.
C5 C6 C16 C31 C34 C36 C55 C60 C77 C80 C82 C91 C108 C111 C113 C122 C144 C145 = SparkFun-Capacitors:1.0UF50V10%(1206): CAP-09822
C7 C19 C38 C63 C83 C94 C114 C125 = SparkFun-Capacitors:0.1UF-25V-5%(0603): CAP-08604; PROD_ID: CAP-08604
C8 C21-C23 C28 C29 C37 C43 C44 C47 C52 C53 C64 C67-C69 C74 C75 C95 C98-C100 C105 C106 C148-C159 = SparkFun-Capacitors:CAP: Capacitor Standard 0603 ceramic capacitor, and 0.1" leaded capacitor.
C15 C20 C25 C26 C39 C40 C49 C50 C65 C66 C71 C72 C96 C97 C102 C103 C126-C141 = SparkFun-Capacitors:0.22UF50V-20%,+80%(0603): CAP-09885; PROD_ID: CAP-09885
C41 = SparkFun:CAP_POL: Capacitor Polarized These are standard SMD and PTH capacitors. Normally 10uF, 47uF, and 100uF in electrolytic and tantalum varieties. Always verify the external diameter of the through hole cap, it varies with capacity, voltage, and manufacturer. The EIA devices should be standard.
C160 C161 = SparkFun-Capacitors:10UF-6.3V-20%(0603): CAP-11015; PROD_ID: CAP-11015
D1 = SparkFun-LED:LED-RED: Assorted Red LEDs LilyPad 1206- DIO-09912 1206- DIO-00809 0603- DIO-00819 "SMART" means more efficient and expensive; PROD_ID: DIO-09912
IC1 IC3 IC5 IC8 IC12 = linear:79*: Negative VOLTAGE REGULATOR
IC2 IC4 IC6 IC7 IC11 = linear:78*: Positive VOLTAGE REGULATOR Source: http://cache.national.com/ds/LM/LM78L05.pdf http://www.fairchildsemi.com/ds/LM/LM7805.pdf
IC9 IC10 = linear:OPA4277: High Precision OPERATIONAL AMPLIFIERS REPLACES OP-07, OP-77, OP-177 Source: opa277.pdf
J1 = SparkFun:POWER_JACK: Power Jack This is the standard 5.5mm barrel jack for power. The PTH is the most common, proven, reliable, footprint. All others are experimental. The Slot footprint only works if the mill layer is transmitted to the PCB fab house so be warned. Spark Fun Electronics SKU : PRT-00119. Mating wall wart : TOL-00298 (and others)
R1 R1_1-R1_8 R2-R32 = SparkFun:RESISTOR: Resistor Basic schematic elements and footprints for 0603, 1206, and PTH 1/10th watt (small) resistors.
R49-R64 = SparkFun-Resistors:15OHM-1/10W-1%(0603); PROD_ID: RES-12570
REF1-REF6 REF3020 REF3040 = texas:REF3020
SV1 = con-harting-ml:ML20: HARTING; OC_FARNELL: unknown; OC_NEWARK: unknown
U$1 U$5 U$13 U$35 U$41 U$42 = texas:ADS1018
U$2 U$10 U$16 U$38 = texas:INA2132
U$3 U$12 U$34 U$40 = texas:DAC7563
U$4 U$11 U$33 U$39 = texas:LM7322
U$6-U$9 U$14 U$15 U$36 U$37 = texas:INA285
U$17-U$32 = SparkFun:DIODE-ZENER: Zener Diode Production Part - 8199 3.4V Zener Voltage
U$43 = dc-dc-converter:TSRN
U$44 = SparkFun-Resistors:0.05OHM-1/5W-1%(0603); PROD_ID: RES-12535
X1 = con-phoenix-254:MPT9: PHOENIX CONNECTOR; OC_FARNELL: unknown; OC_NEWARK: unknown